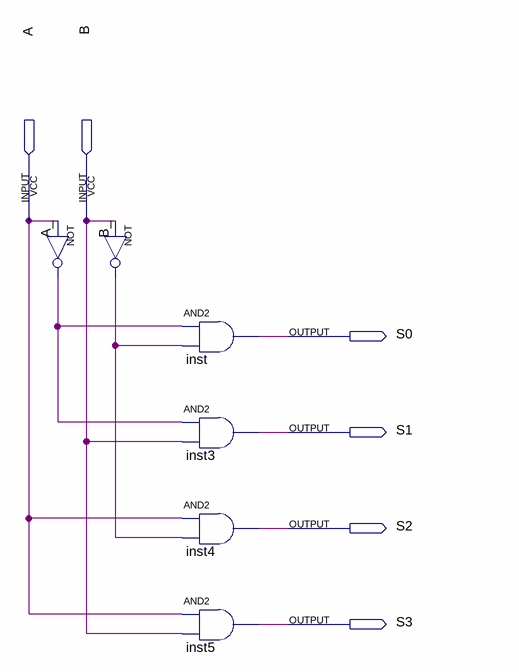
[diagram p0: schematic sheet]
// Quartus schematic DECODER2_4.bdf as structural Verilog: 6 symbols, 6 pins
module DECODER2_4 (
  input  A,
  input  B,
  output S0,
  output S1,
  output S2,
  output S3
);

  wire A__out, B__out;

  not A_ (A__out, A);
  not B_ (B__out, B);
  and inst (S0, A__out, B__out);
  and inst3 (S1, A__out, B);
  and inst4 (S2, A, B__out);
  and inst5 (S3, A, B);
endmodule
